# Altium schematic sheet BMS_IC.SchDoc
size Letter
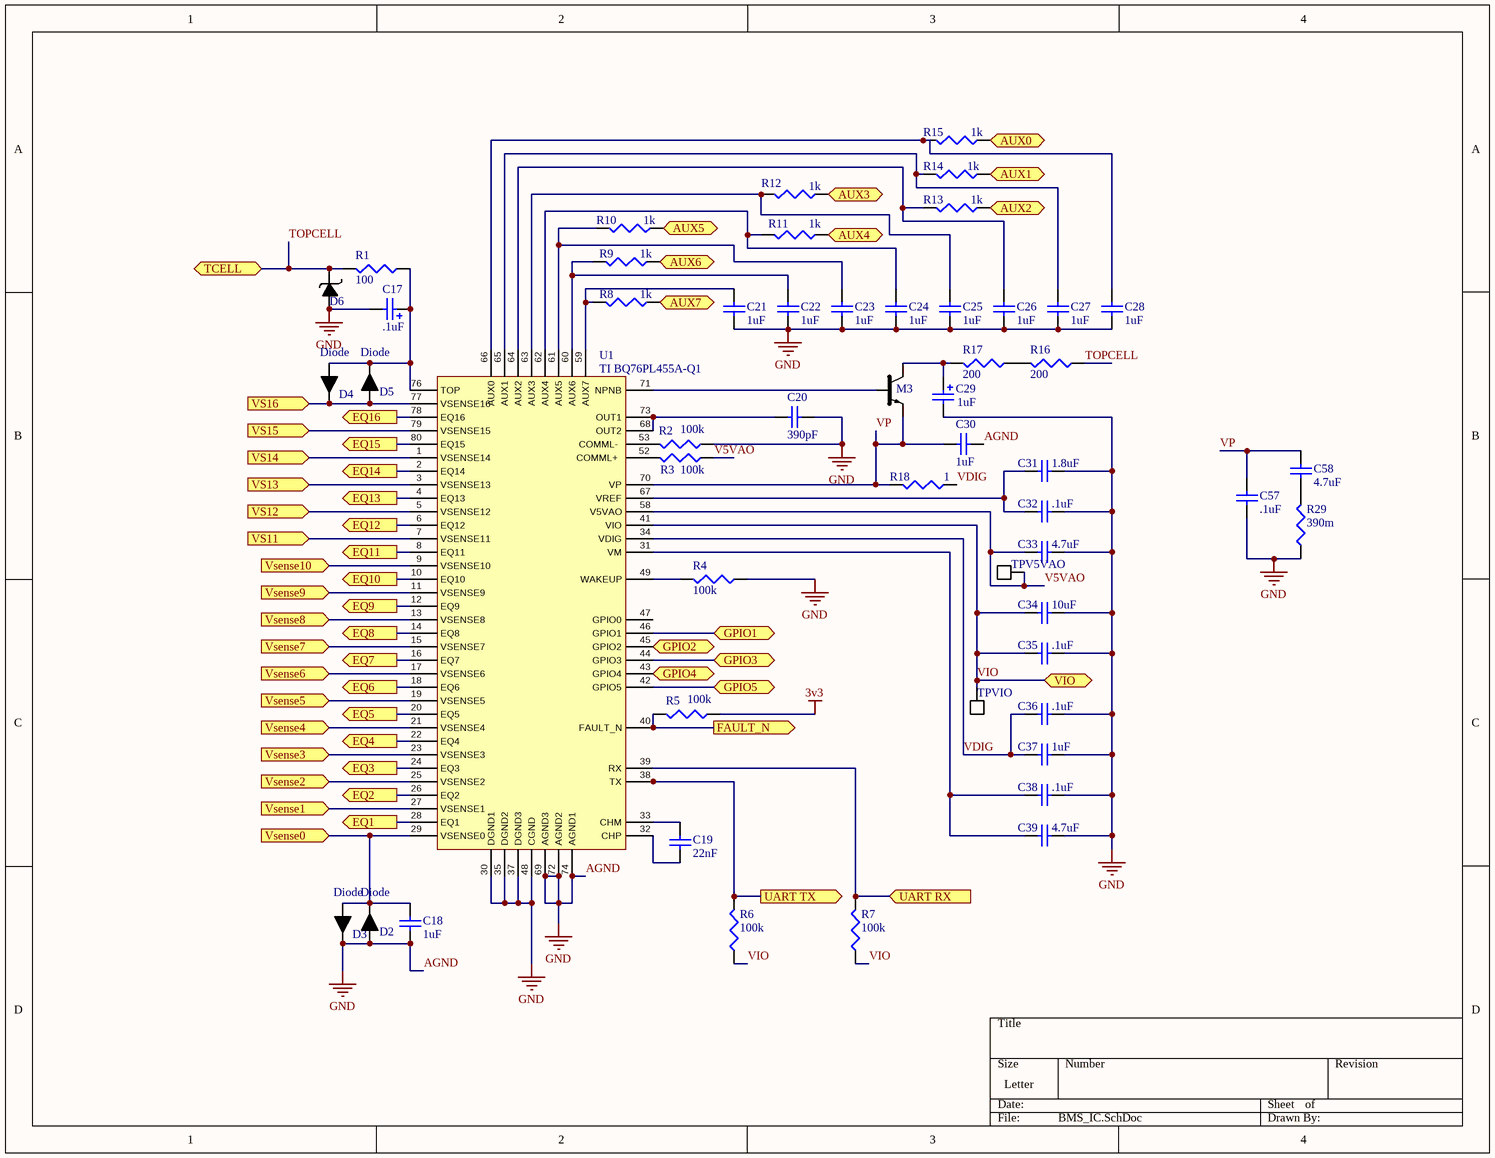
[diagram p0: BMS_IC.SchDoc]

## Parts
C17  value .1uF  [SMD1206 Polarized]  (hidden comment: Cap)
C18  value 1uF  [SMD0603]  (hidden comment: Cap)
C19  value 22nF  [SMD0603]  (hidden comment: Cap)
C20  value 390pF  [SMD0805]  (hidden comment: Cap)
C21  value 1uF  [SMD0603]  (hidden comment: Cap)
C22  value 1uF  [SMD0603]  (hidden comment: Cap)
C23  value 1uF  [SMD0603]  (hidden comment: Cap)
C24  value 1uF  [SMD0603]  (hidden comment: Cap)
C25  value 1uF  [SMD0603]  (hidden comment: Cap)
C26  value 1uF  [SMD0603]  (hidden comment: Cap)
C27  value 1uF  [SMD0603]  (hidden comment: Cap)
C28  value 1uF  [SMD0603]  (hidden comment: Cap)
C29  value 1uF  [SMD1206 Polarized]  (hidden comment: Cap)
C30  value 1uF  [SMD0603]  (hidden comment: Cap)
C31  value 1.8uF  [SMD0603]  (hidden comment: Cap)
C32  value .1uF  [SMD0603]  (hidden comment: Cap)
C33  value 4.7uF  [SMD0603]  (hidden comment: Cap)
C34  value 10uF  [SMD0603]  (hidden comment: Cap)
C35  value .1uF  [SMD0603]  (hidden comment: Cap)
C36  value .1uF  [SMD0603]  (hidden comment: Cap)
C37  value 1uF  [SMD0603]  (hidden comment: Cap)
C38  value .1uF  [SMD0603]  (hidden comment: Cap)
C39  value 4.7uF  [SMD0603]  (hidden comment: Cap)
C57  value .1uF  [SMD0603]  (hidden comment: Cap)
C58  value 4.7uF  [SMD0603]  (hidden comment: Cap)
D2  Diode  [DPAK23]
D3  Diode  [DPAK23]
D4  Diode  [DPAK23]
D5  Diode  [DPAK23]
D6  Zener Diode  [TVS Diode]  (value not drawn)
M3  BJT  [SOT23]  (value not drawn)
R1  value 100  [SMD0603]  (hidden comment: Res)
R2  value 100k  [SMD0603]  (hidden comment: Res)
R3  value 100k  [SMD0603]  (hidden comment: Res)
R4  value 100k  [SMD0603]  (hidden comment: Res)
R5  value 100k  [SMD0603]  (hidden comment: Res)
R6  value 100k  [SMD0603]  (hidden comment: Res)
R7  value 100k  [SMD0603]  (hidden comment: Res)
R8  value 1k  [SMD0603]  (hidden comment: Res)
R9  value 1k  [SMD0603]  (hidden comment: Res)
R10  value 1k  [SMD0603]  (hidden comment: Res)
R11  value 1k  [SMD0603]  (hidden comment: Res)
R12  value 1k  [SMD0603]  (hidden comment: Res)
R13  value 1k  [SMD0603]  (hidden comment: Res)
R14  value 1k  [SMD0603]  (hidden comment: Res)
R15  value 1k  [SMD0603]  (hidden comment: Res)
R16  value 200  [SMD0603]  (hidden comment: Res)
R17  value 200  [SMD0603]  (hidden comment: Res)
R18  value 1  [SMD0603]  (hidden comment: Res)
R29  value 390m  [SMD0603]  (hidden comment: Res)
TPV5VAO  Test Point  [Test Point]  (value not drawn)
TPVIO  Test Point  [Test Point]  (value not drawn)
U1  TI BQ76PL455A-Q1  [TQFP-80]

## Ports
AUX0 (in), AUX1 (in), AUX2 (in), AUX3 (in), AUX4 (in), AUX5 (in), AUX6 (in), AUX7 (in), EQ1 (out), EQ2 (out), EQ3 (out), EQ4 (out), EQ5 (out), EQ6 (out), EQ7 (out), EQ8 (out), EQ9 (out), EQ10 (out), EQ11 (out), EQ12 (out), EQ13 (out), EQ14 (out), EQ15 (out), EQ16 (out), FAULT_N (out), GPIO1 (bidir), GPIO2 (bidir), GPIO3 (bidir), GPIO4 (bidir), GPIO5 (bidir), TCELL (bidir), UART RX (in), UART TX (out), VIO (bidir), VS11 (in), VS12 (in), VS13 (in), VS14 (in), VS15 (in), VS16 (in), Vsense0 (in), Vsense1 (in), Vsense2 (in), Vsense3 (in), Vsense4 (in), Vsense5 (in), Vsense6 (in), Vsense7 (in), Vsense8 (in), Vsense9 (in), Vsense10 (in)

## Nets
3v3: R5.1
AGND: C17.2 C18.1 C20.1 C21.1 C22.1 C23.1 C24.1 C25.1 C26.1 C27.1 C28.1 C29.2 C30.1 C31.1 C32.1 C33.1 C34.1 C35.1 C36.1 C37.1 C38.1 C39.1 C57.1 D2.3(Anode_(+)) D3.2(Cathode_(-)) D6.1 R2.1 R4.1 R29.1 U1.30(DGND1) U1.35(DGND2) U1.37(DGND3) U1.48(CGND) U1.69(AGND3) U1.72(AGND2) U1.74(AGND1)  [also labelled GND]
AUX0: R15.1 ; port AUX0
AUX1: R14.1 ; port AUX1
AUX2: R13.1 ; port AUX2
AUX3: R12.1 ; port AUX3
AUX4: R11.1 ; port AUX4
AUX5: R10.1 ; port AUX5
AUX6: R9.1 ; port AUX6
AUX7: R8.1 ; port AUX7
EQ1: U1.28(EQ1) ; port EQ1
EQ2: U1.26(EQ2) ; port EQ2
EQ3: U1.24(EQ3) ; port EQ3
EQ4: U1.22(EQ4) ; port EQ4
EQ5: U1.20(EQ5) ; port EQ5
EQ6: U1.18(EQ6) ; port EQ6
EQ7: U1.16(EQ7) ; port EQ7
EQ8: U1.14(EQ8) ; port EQ8
EQ9: U1.12(EQ9) ; port EQ9
EQ10: U1.10(EQ10) ; port EQ10
EQ11: U1.8(EQ11) ; port EQ11
EQ12: U1.6(EQ12) ; port EQ12
EQ13: U1.4(EQ13) ; port EQ13
EQ14: U1.2(EQ14) ; port EQ14
EQ15: U1.80(EQ15) ; port EQ15
EQ16: U1.78(EQ16) ; port EQ16
FAULT_N: R5.2 U1.40(FAULT_N) ; port FAULT_N
GPIO1: U1.46(GPIO1) ; port GPIO1
GPIO2: U1.45(GPIO2) ; port GPIO2
GPIO3: U1.44(GPIO3) ; port GPIO3
GPIO4: U1.43(GPIO4) ; port GPIO4
GPIO5: U1.42(GPIO5) ; port GPIO5
TOPCELL: D6.2 R1.2 R16.1 ; port TCELL
UART RX: R7.2 U1.39(RX) ; port UART RX
UART TX: R6.2 U1.38(TX) ; port UART TX
V5VAO: C33.2 R3.1 TPV5VAO.1 U1.58(V5VAO)
VDIG: C36.2 C37.2 R18.1 U1.34(VDIG)
VIO: C34.2 C35.2 R6.1 R7.1 TPVIO.1 U1.41(VIO) ; port VIO
VP: C30.2 C57.2 C58.2 M3.3 R18.2 U1.70(VP)
VS11: U1.7(VSENSE11) ; port VS11
VS12: U1.5(VSENSE12) ; port VS12
VS13: U1.3(VSENSE13) ; port VS13
VS14: U1.1(VSENSE14) ; port VS14
VS15: U1.79(VSENSE15) ; port VS15
VS16: D4.2(Cathode_(-)) D5.3(Anode_(+)) U1.77(VSENSE16) ; port VS16
Vsense0: C18.2 D2.2(Cathode_(-)) D3.3(Anode_(+)) U1.29(VSENSE0) ; port Vsense0
Vsense1: U1.27(VSENSE1) ; port Vsense1
Vsense2: U1.25(VSENSE2) ; port Vsense2
Vsense3: U1.23(VSENSE3) ; port Vsense3
Vsense4: U1.21(VSENSE4) ; port Vsense4
Vsense5: U1.19(VSENSE5) ; port Vsense5
Vsense6: U1.17(VSENSE6) ; port Vsense6
Vsense7: U1.15(VSENSE7) ; port Vsense7
Vsense8: U1.13(VSENSE8) ; port Vsense8
Vsense9: U1.11(VSENSE9) ; port Vsense9
Vsense10: U1.9(VSENSE10) ; port Vsense10
NetC17_1: C17.1 D4.3(Anode_(+)) D5.2(Cathode_(-)) R1.1 U1.76(TOP)
NetC19_1: C19.1 U1.32(CHP)
NetC19_2: C19.2 U1.33(CHM)
NetC20_2: C20.2 U1.68(OUT2) U1.73(OUT1)
NetC21_2: C21.2 R8.2 U1.59(AUX7)
NetC22_2: C22.2 R9.2 U1.60(AUX6)
NetC23_2: C23.2 R10.2 U1.61(AUX5)
NetC24_2: C24.2 R11.2 U1.62(AUX4)
NetC25_2: C25.2 R12.2 U1.63(AUX3)
NetC26_2: C26.2 R13.2 U1.64(AUX2)
NetC27_2: C27.2 R14.2 U1.65(AUX1)
NetC28_2: C28.2 R15.2 U1.66(AUX0)
NetC29_1: C29.1 M3.1 R17.2
NetC31_2: C31.2 C32.2 U1.67(VREF)
NetC38_2: C38.2 C39.2 U1.31(VM)
NetC58_1: C58.1 R29.2
NetM3_2: M3.2 U1.71(NPNB)
NetR2_2: R2.2 U1.53(COMML-)
NetR3_2: R3.2 U1.52(COMML+)
NetR4_2: R4.2 U1.49(WAKEUP)
NetR16_2: R16.2 R17.1

Not connected (* = marked no-connect by the designer): U1 47(GPIO0)

## Library data of the parts
C17 C29 = Capacitor Polarized: Polarized Capacitor (Surface Mount)
C18-C28 C30-C39 C57 C58 = Capacitor Ceramic: Ceramic Chip Capacitor
R1-R18 R29 = Resistor
TPV5VAO TPVIO = Test Point: Supplier 1: Digi-Key; Supplier Part Number 1: 5019KCT-ND